# Altium schematic sheet bank 34.SchDoc
size A4; SheetNumber: 2; SheetTotal: 9
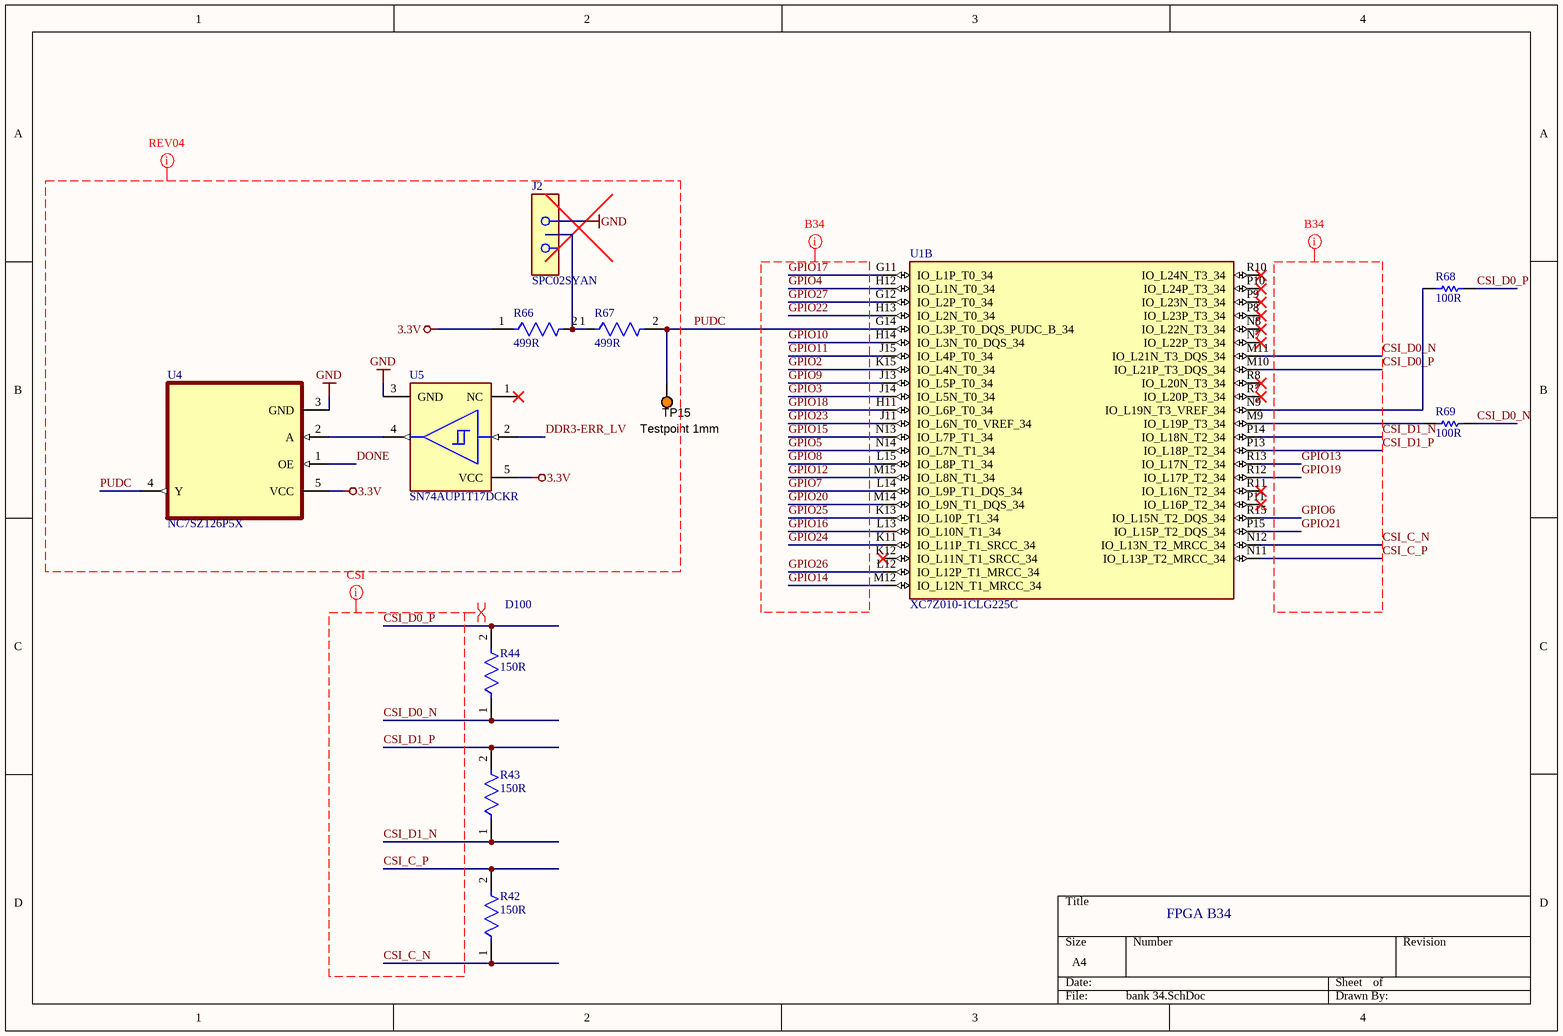
[diagram p0: bank 34.SchDoc]

## Parts
J2  SPC02SYAN  [FP-SPC02SYAN-MFG]
R42  150R  [FP-RT0402-MFG]
R43  150R  [FP-RT0402-MFG]
R44  150R  [FP-RT0402-MFG]
R66  499R  [FP-RQ731J-IPC_C]
R67  499R  [FP-RQ731J-IPC_C]
R68  100R  [RESC0603X28X15LL05T05]
R69  100R  [RESC0603X28X15LL05T05]
TP15  Testpoint 1mm  [KSTN-5003]
U1  XC7Z010-1CLG225C  [BGA225C80P15X15_1300X1300X150]  (part B of 6)
U4  NC7SZ126P5X  [SOT65P210X110-5N]
U5  SN74AUP1T17DCKR  [FP-DCK0005A-IPC_B]

## Nets
3.3V: R66.1 U4.5(VCC) U5.5(VCC)
GND: U4.3(GND) U5.3(GND)
CSI_C_N: R42.1 U1.N12(IO_L13N_T2_MRCC_34)
CSI_C_P: R42.2 U1.N11(IO_L13P_T2_MRCC_34)
CSI_D0_N: R44.1 R69.2 U1.M11(IO_L21N_T3_DQS_34)
CSI_D0_P: R44.2 R68.2 U1.M10(IO_L21P_T3_DQS_34)
CSI_D1_N: R43.1 U1.P14(IO_L18N_T2_34)
CSI_D1_P: R43.2 U1.P13(IO_L18P_T2_34)
DDR3-ERR_LV: U5.2(A)
DONE: U4.1(OE)
GPIO2: U1.K15(IO_L4N_T0_34)
GPIO3: U1.J14(IO_L5N_T0_34)
GPIO4: U1.H12(IO_L1N_T0_34)
GPIO5: U1.N14(IO_L7N_T1_34)
GPIO6: U1.R15(IO_L15N_T2_DQS_34)
GPIO7: U1.L14(IO_L9P_T1_DQS_34)
GPIO8: U1.L15(IO_L8P_T1_34)
GPIO9: U1.J13(IO_L5P_T0_34)
GPIO10: U1.H14(IO_L3N_T0_DQS_34)
GPIO11: U1.J15(IO_L4P_T0_34)
GPIO12: U1.M15(IO_L8N_T1_34)
GPIO13: U1.R13(IO_L17N_T2_34)
GPIO14: U1.M12(IO_L12N_T1_MRCC_34)
GPIO15: U1.N13(IO_L7P_T1_34)
GPIO16: U1.L13(IO_L10N_T1_34)
GPIO17: U1.G11(IO_L1P_T0_34)
GPIO18: U1.H11(IO_L6P_T0_34)
GPIO19: U1.R12(IO_L17P_T2_34)
GPIO20: U1.M14(IO_L9N_T1_DQS_34)
GPIO21: U1.P15(IO_L15P_T2_DQS_34)
GPIO22: U1.H13(IO_L2N_T0_34)
GPIO23: U1.J11(IO_L6N_T0_VREF_34)
GPIO24: U1.K11(IO_L11P_T1_SRCC_34)
GPIO25: U1.K13(IO_L10P_T1_34)
GPIO26: U1.L12(IO_L12P_T1_MRCC_34)
GPIO27: U1.G12(IO_L2P_T0_34)
PUDC: R67.2 TP15.1 U1.G14(IO_L3P_T0_DQS_PUDC_B_34) U4.4(Y)
NetR66_2: R66.2 R67.1
NetR68_1: R68.1 U1.N9(IO_L19N_T3_VREF_34)
NetR69_1: R69.1 U1.M9(IO_L19P_T3_34)
NetU4_2: U4.2(A) U5.4(Y)

Not connected (* = marked no-connect by the designer): U1 K12(IO_L11N_T1_SRCC_34)* N7(IO_L22P_T3_34)* N8(IO_L22N_T3_34)* P8(IO_L23P_T3_34)* P9(IO_L23N_T3_34)* P10(IO_L24P_T3_34)* P11(IO_L16P_T2_34)* R7(IO_L20P_T3_34)* R8(IO_L20N_T3_34)* R10(IO_L24N_T3_34)* R11(IO_L16N_T2_34)*; U5 1(NC)*

## Layout directives
mark named B34: CSI_C_N, CSI_C_P, CSI_D0_N, CSI_D0_P, CSI_D1_N, CSI_D1_P, GPIO2, GPIO3, GPIO4, GPIO5, GPIO6, GPIO7, GPIO8, GPIO9, GPIO10, GPIO11, GPIO12, GPIO13, GPIO14, GPIO15, GPIO16, GPIO17, GPIO18, GPIO19, GPIO20, GPIO21, GPIO22, GPIO23, GPIO24, GPIO25, GPIO26, GPIO27
mark named REV04: 3.3V, DDR3-ERR_LV, DONE, GND, PUDC
differential pair: CSI_C_N, CSI_C_P, CSI_D0_N, CSI_D0_P, CSI_D1_N, CSI_D1_P
mark named CSI: CSI_C_N, CSI_C_P, CSI_D0_N, CSI_D0_P, CSI_D1_N, CSI_D1_P

## Notes on the sheet
- (near R44) D100
- FPGA B34

## Library data of the parts
J2 = CMP-25666-000002-1: CONN JUMPER SHORTING GOLD FLASH; Pitch: 0.1inch; Number of Positions: 2; Lead Free: Lead Free; Packaging: Bulk; RoHS Compliant: Yes; Package Quantity: 1000; Height: 0.256inch; Contact Plating: Gold; Color: Black
R42-R44 = CMP-2002-02665-2: RES SMD 150 OHM 0.1% 1/16W 0402; Manufacturer: Yageo; Manufacturer Part Number: RT0402BRD07150RL; Voltage Rating: 50V; Temperature Coefficient: 25 ppm/°C; Resistance: 150Ω; Tolerance: 0.001; Power Rating: 0.063W; Value: 150Ω; Temperature: -55°C to +155°C; Package: RT0402; ComponentLink2Description: Datasheet; Automotive: No; Height: 0.35mm; Device Class L3: Chip SMD Resistors; Device Class L1: Passive Components; Temperature Range High: +155°C; Footprint Url: http://www.yageo.com/exep/pages/download/literatures/PYu-R_Mount_10.pdf; Digikey Description: RES SMD 150 OHM 0.1% 1/16W 0402; RoHS: TRUE; Mouser Description: Res Thin Film 0402 150 Ohm 0.1% 1/16W ±25ppm/°C Molded SMD Paper T/R; Lead Free: Yes; Category: Res; Series: RT; Temperature Range Low: -55°C; Octopart: https://octopart.com/rt0402brd07150rl-yageo-1440817; Composition: Thin Film; ComponentLink2URL: http://www.yageo.com/documents/recent/PYu-RT_1-to-0.01_RoHS_L_9.pdf; Ipc Land Pattern Name: RESC10050X30; Device Class L2: Resistors
R66 R67 = CMP-03211-008015-1: RQ73 0603 499Ω  0.15W 10ppm/°C 0.1% 75V; Manufacturer: TE; Manufacturer Part Number: RQ73C1J499RBTD; Automotive Grade: Grade 0; Composition: Thin Film; Temperature: -55°C to +155°C; Temperature Range Low: -55°C; Resistance: 499Ω; ComponentLink2Description: Datasheet; Voltage Rating: 75V; Device Class L2: Resistors; RoHS: TRUE; Package: RQ731J; Power Rating: 0.15W; Series: RQ73; Device Class L3: Chip SMD Resistors; Height: 0.6mm; Value: 499Ω; Temperature Range High: +155°C; Automotive: Yes; Temperature Coefficient: 10ppm/°C; Device Class L1: Passive Components; Category: Res; Tolerance: 0.1%; Ipc Land Pattern Name: RESC15580X45; ComponentLink2URL: https://www.te.com/commerce/DocumentDelivery/DDEController?Action=showdoc&DocId=Data+Sheet%7F1773270-2%7FA%7Fpdf%7FEnglish%7FENG_DS_1773270-2_A.pdf%7F4-2176362-2; Octopart: https://octopart.com/rq73c1j499rbtd-te+connectivity-93908871; Lead Free: Yes
R68 R69 = CMP-2004-00007-1: Part Number: CRCW0201100RJNED; Manufacturer: Vishay
TP15 = CMP-1672-00009-1: Test Point, Orange, 1-Pin THD, RoHS; Peak Reverse Current: 600 uA; Forward Current: 3 A; Max Surge Current: 80 A; Forward Voltage: 1.08 V; Max Operating Temperature: 150 degC; PackageReference: 5003; Pins: 2; ComponentLink2URL: http://keyelco.com/userAssets/file/M65p56.pdf; PackageDescription: 1-Pin Through Hole Device, Dia 2.54 mm; Weight: 0.01 lb; Diameter: 5.3 mm; Mount: Through Hole; Package Quantity: 500; Packaging: Bulk; Min Operating Temperature: -65 degC; ComponentLink1Description: Manufacturer URL; Height: 0.25 inch; ComponentLink1URL: http://www.keyelco.com/; ComponentLink2Description: Datasheet; Width: 0.25 inch; REACH SVHC: No SVHC; RoHSCompliant: true; Radiation Hardening: No; Length: 9.5 mm; DatasheetVersion: Jun-15
U1 = XC7Z010-1CLG225C: Dual ARMÂ® CortexÂ®-A9 MPCoreâ„¢ with CoreSightâ„¢ System On Chip _SOC_ IC ZynqÂ®-7000 Artixâ„¢-7 FPGA, 28K Logic Cells 667MHz 225-CSPBGA _13x13_; MF: Xilinx Inc.; Value: *; SnapEDA_Link: https://www.snapeda.com/parts/XC7Z010-1CLG225C/Xilinx%20Inc./view-part/45778/?ref=snap; Digi-Key_Part_Number: 122-1855-ND; Package: CSPBGA-225 Xilinx; Digi-Key_Purchase_URL: https://www.digikey.by/product-detail/en/xilinx-inc/XC7Z010-1CLG225C/122-1855-ND/3925788?utm_source=snapeda&utm_medium=aggregator&utm_campaign=symbol; MP: XC7Z010-1CLG225C
U4 = NC7SZ126P5X: Buffer, Non-Inverting 1 Element 1 Bit per Element 3-State Output SC-70-5; MF: ON Semiconductor; Mouser-Purchase-URL: https://snapeda.com/shop?store=Mouser&id=7000; Package: SC-70-5 Fairchild Semiconductor; SnapEDA_Link: https://www.snapeda.com/parts/NC7SZ126P5X/ON%20Semiconductor/view-part/7000/?ref=snap; Value: *; Price: None; Arrow_Electronics-Purchase-URL: https://snapeda.com/shop?store=Arrow+Electronics&id=7000; DigiKey-Purchase-URL: https://snapeda.com/shop?store=DigiKey&id=7000; MP: NC7SZ126P5X; Arrow_Europe-Purchase-URL: https://snapeda.com/shop?store=Arrow+Europe&id=7000; Availability: Good
U5 = CMP-0859-00332-5: IC BUF NON-INVERT 3.6V SC70-5; Turn-On Delay Time: 10.8ns; Nominal Supply Current: 900nA; Logic Function: Schmitt Trigger; Number of Bits: 1; Schmitt Trigger Input: Yes; Min Supply Voltage: 2.3V; Propagation Delay: 5.1ns; Low Level Output Current: 4mA; High Level Output Current: -4mA; Quiescent Current: 500nA; Polarity: Non-Inverting; REACH SVHC: No SVHC; Lead Free: Lead Free; Case/Package: SC; Radiation Hardening: No; Mount: Surface Mount; Technology: CMOS; Number of Elements: 1; Length: 2.15mm; Number of Outputs: 1; Number of Channels: 1; RoHS Compliant: Yes; Supply Current: 900nA; Number of Bits per Element: 1; Package Quantity: 3000; Series: 74AUP; Number of Inputs: 1; Width: 1.4mm; Max Operating Temperature: 85°C; Number of Gates: 1; Height: 1mm; Packaging: Tape and Reel; Max Supply Voltage: 3.6V; Min Operating Temperature: -40°C; Number of Pins: 5